# Altium project E4G.PrjPcb
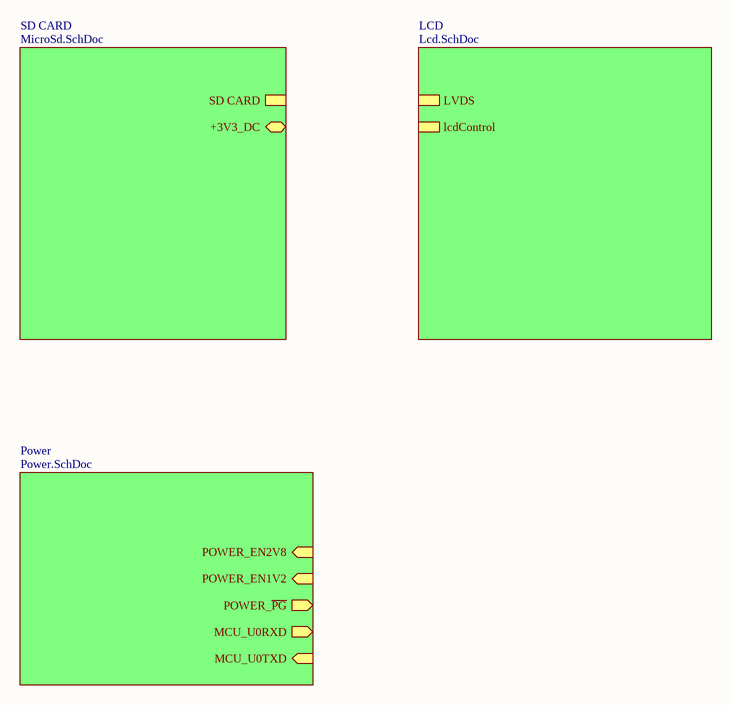
[diagram p0: Main.SchDoc]
4 sheets, 84 parts. Net scope: hierarchical (ports join the sheet entries above them; power ports are global).
Sheets:
  Main.SchDoc
    LCD = Lcd.SchDoc
    SD CARD = MicroSd.SchDoc
  Interfaces.SchDoc

## Sheet Main.SchDoc
size A4; SheetNumber: 1; SheetTotal: 4

### Sub-sheets
LCD = Lcd.SchDoc: LVDS (harness LVDS), lcdControl (harness lcdControl)
Power = Power.SchDoc (file not in this document): POWER_EN2V8 (in), POWER_EN1V2 (in), POWER_~{PG} (out), MCU_U0RXD (out), MCU_U0TXD (in)
SD CARD = MicroSd.SchDoc: SD CARD (harness SDIO), +3V3_DC (bidir, harness +3V3_DC)

## Sheet Lcd.SchDoc
size A4; SheetNumber: 3; SheetTotal: 3; SPICEModelCacheGUJJYSLL: <root> / <DocumentId>GUJJYSLL</DocumentId> / <CacheFrame Number="0"> / <Model Name="bat54s" Kind="CKT"> / <Text>* / .SUBCKT BAT54S 1 2 3 / * The resistors do not reflect / * physical devices.  Instead they / * improve modeling in the reverse / * mode of operation. / * / R1 1 3 3.6E+07 / D1 1 3 BAT54S / R2 3 2 3.6E+07 / D2 3 2 BAT54S / * / .MODEL BAT54S D / +( / +    IS = 2.117E-07 / +    N = 1.016 / +    BV = 36 / +    IBV = 1.196E-06 / +    RS = 2.637 / +    CJO = 1.114E-11 / +    VJ = 0.2013 / +    M = 0.3868 / +    FC = 0 / +    TT = 0 / +    EG = 0.69 / +    XTI = 2 / +) / .ENDS</Text> / </Model> / </CacheFrame> / </root>
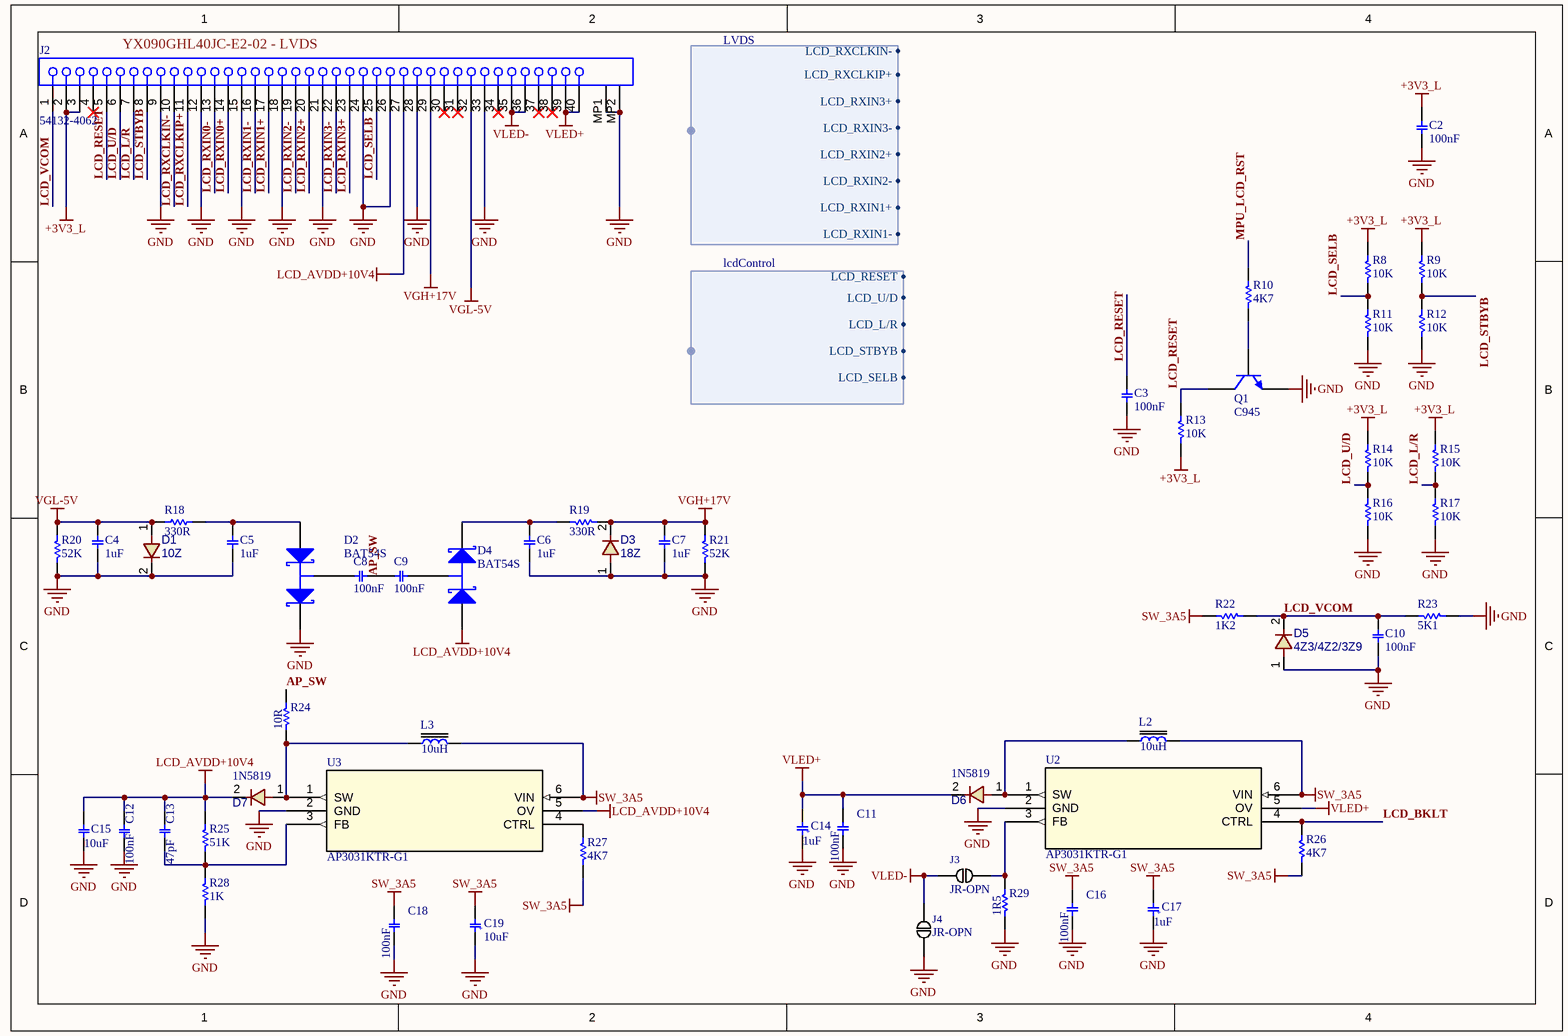
[diagram p1: Lcd.SchDoc]

### Parts
(Parts that share a designator on the sheet are numbered #1, #2 ... from top to bottom, then left to right.)
C2  100nF  [C0603E]
C3  100nF  [C0603E]
C4  1uF  [C0603E]
C5  1uF  [C0603E]
C6  1uF  [C0603E]
C7  1uF  [C0603E]
C8  100nF  [C0603E]
C9  100nF  [C0603E]
C10  100nF  [C0603E]
C11  100nF  [C0603E]
C12  100nF  [C0603E]
C13  47pF  [C0603E]
C14  1uF  [Cap_A]
C15  10uF  [C0603E]
C16  100nF  [C0603E]
C17  1uF  [Cap_A]
C18  100nF  [C0603E]
C19  10uF  [Cap_A]
D1  10Z  [D_SOD80]
D2  BAT54S  [SOT-23]
D3  18Z  [D_SOD80]
D4  BAT54S  [SOT-23]
D5  4Z3/4Z2/3Z9  [D_SOD80]
D6  value 1N5819  [D_SMA]  (hidden comment: 1N5819 SMD SS31)
D7  value 1N5819  [D_SMA]  (hidden comment: 1N5819 SMD SS31)
J2  54132-4062  [MOLX-54132-4062]
J3  JR-OPN
J4  JR-OPN
L2  10uH  [L_XAL1010]
L3  10uH  [L_XAL1010]
Q1  C945  [SOT23_N]
R8  10K  [R0603O]
R9  10K  [R0603O]
R10  4K7  [R0603O]
R11  10K  [R0603O]
R12  10K  [R0603O]
R13  10K  [R0603O]
R14  10K  [R0603O]
R15  10K  [R0603O]
R16  10K  [R0603O]
R17  10K  [R0603O]
R18  330R  [R0603O]
R19  330R  [R0603O]
R20  52K  [R0603O]
R21  52K  [R0603O]
R22#1  1K2  [R0603O]
R23  5K1  [R0603O]
R24#1  10R  [R0603O]
R25#1  51K  [R0603O]
R26#1  4K7  [R0603O]
R27#1  4K7  [R0603O]
R28  1K  [R0603O]
R29  1R5  [R0603O]
U2#1  AP3031KTR-G1  [SOT23-6_DIO]
U3#1  AP3031KTR-G1  [SOT23-6_DIO]

### Harnesses
LVDS: LCD_RXCLKIN-, LCD_RXCLKIP+, LCD_RXIN3+, LCD_RXIN3-, LCD_RXIN2+, LCD_RXIN2-, LCD_RXIN1+, LCD_RXIN1-
lcdControl: LCD_RESET, LCD_U/D, LCD_L/R, LCD_STBYB, LCD_SELB

### Nets
+3V3_L: C2.2 J2.2 J2.3 R8.1 R9.1 R13.2 R14.1 R15.1
GND: C2.1 C3.1 C4.1 C5.1 C6.1 C7.1 C10.1 C11.1 C12.1 C14.2 C15.1 C16.1 C17.2 C18.1 C19.2 D1.2 D2.2(K) D3.1 D5.1 J2.9 J2.12 J2.15 J2.18 J2.21 J2.24 J2.26 J2.28 J2.33 J2.MP1 J2.MP2 J4.2 Q1.2(E) R11.2 R12.1 R16.2 R17.2 R20.1 R21.1 R23.1 R28.1 R29.1 U2#1.2(GND) U3#1.2(GND)
LCD_AVDD+10V4: C12.2 C13.2 C15.2 D4.1(A) D7.2 J2.27 R25#1.2 U3#1.5(OV)
SW_3A5: C16.2 C17.1 C18.2 C19.1 L2.2 L3.2 R22#1.2 R26#1.1 R27#1.1 U2#1.6(VIN) U3#1.6(VIN)
VGH+17V: C7.2 D3.2 J2.29 R19.1 R21.2
VGL-5V: C4.2 D1.1 J2.32 R18.1 R20.2
VLED+: C11.2 C14.1 D6.2 J2.39 J2.40 U2#1.5(OV)
VLED-: J2.35 J2.36 J3.1 J4.1
AP_SW: C8.1 C9.2 R24#1.2
LCD_BKLT: R26#1.2 U2#1.4(CTRL)
LCD_L/R: J2.7 R15.2 R17.1
LCD_RESET: C3.2 J2.5 Q1.3(C) R13.1
LCD_RXCLKIN-: J2.10
LCD_RXCLKIP+: J2.11
LCD_RXIN0+: J2.14
LCD_RXIN0-: J2.13
LCD_RXIN1+: J2.17
LCD_RXIN1-: J2.16
LCD_RXIN2+: J2.20
LCD_RXIN2-: J2.19
LCD_RXIN3+: J2.23
LCD_RXIN3-: J2.22
LCD_SELB: J2.25 R8.2 R11.1
LCD_STBYB: J2.8 R9.2 R12.2
LCD_U/D: J2.6 R14.2 R16.1
LCD_VCOM: C10.2 D5.2 J2.1 R22#1.1 R23.2
MPU_LCD_RST: R10.1
NetC5_2: C5.2 D2.1(A) R18.2
NetC6_2: C6.2 D4.2(K) R19.2
NetC8_2: C8.2 D2.3(C)
NetC9_1: C9.1 D4.3(C)
NetC13_1: C13.1 R25#1.1 R28.2 U3#1.3(FB)
NetD6_1: D6.1 L2.1 U2#1.1(SW)
NetD7_1: D7.1 L3.1 R24#1.1 U3#1.1(SW)
NetJ3_2: J3.2 R29.2 U2#1.3(FB)
NetQ1_1: Q1.1(B) R10.2
NetR27#1_2: R27#1.2 U3#1.4(CTRL)

Not connected (* = marked no-connect by the designer): J2 4* 30* 31* 34* 37* 38*

### Notes on the sheet
- (near J2) YX090GHL40JC-E2-02 - LVDS
- THIS DOCUMENT AND THE DATA DISCLOSED HEREIN OR
- HEREWITH IS THE PROPERTY OF ALTIUM LIMITED AND MAY
- DWG NO:
- REVISION
- REV:
- DESCRIPTION
- DATE
- APPROVED
- BE FREELY DISTRIBUTED IN WHOLE. NO RIGHTS ARE
- RESERVED OR EXPRESS OR IMPLIED WARANTEE GIVEN.
- ENG:
- APPROVALS
- PROJECT
- DSN:
- CHK:
- REFERENCE DOCUMENTS
- PROJECT REVISION:
- TITLE
- DOCUMENT REVISION:
- DESIGN ITEM:
- BOM:
- FAB DWG:
- PCB DWG:
- ASSY DWG:
- SCALE:
- A3
- SIZE
- CAGE CODE
- FILE NAME
- DWG NO.
- SHEET
- OF
- REV
- (in symbol Capacitor Tantalum SMD) +

### Library data of the parts
C2-C12 C15 C16 C18 = Capacitor C SMD 0603
  C2 C3 C8-C12 C16 C18: DatasheetVersion: 2021; ComponentLink1Description: Website Smart World; ComponentLink1URL: https://www.smartw.ir/; ComponentLink2Description: Telegram; ComponentLink2URL: https://t.me/altium_smartw; ComponentLink3Description: Instagram; ComponentLink3URL: https://Instagram.com/smartgw.ir; Value: 100nf
C13 = Capacitor C SMD 0603: Value: 100nf; DatasheetVersion: 2021; ComponentLink1Description: Website Smart World; ComponentLink1URL: https://www.smartw.ir/; ComponentLink2Description: Telegram; ComponentLink2URL: https://t.me/altium_smartw; ComponentLink3Description: Instagram; ComponentLink3URL: https://Instagram.com/smartgw.ir
C14 C17 C19 = Capacitor Tantalum SMD: DatasheetVersion: 2021; ComponentLink1Description: Website Smart World; ComponentLink1URL: https://www.smartw.ir/; ComponentLink2Description: Telegram; ComponentLink2URL: https://t.me/altium_smartw; ComponentLink3Description: Instagram; ComponentLink3URL: https://Instagram.com/smartgw.ir
  C19: Value: 10uF
D1 D3 D5 = 1N4148 SMD: DIODE, FAST SWTICHING, 0.3A, 0.5W
D2 D4 = BAT54S: Schottky Barrier Double Diode; Published: 17-Sep-2003; LatestRevisionDate: 12-Dec-2006; LatestRevisionNote: IPC-7351 Footprint Added.; DatasheetVersion: 4-Mar-2002; PackageVersion: May-1999; PackageReference: SOT23; Publisher: Altium Limited; PackageDescription: 3-Pin SOT-23 Package 0.95 mm Pitch, 2.3 mm Lead Span; ComponentLink1Description: Manufacturer Link; ComponentLink1URL: http://www.semiconductors.philips.com/; ComponentLink2Description: Datasheet; ComponentLink2URL: http://www.semiconductors.philips.com/acrobat/datasheets/BAT54_SERIES_4.pdf
D6 D7 = 1N4007 SMD M7: DIODE, GENERAL PURPOSE, 1000V/1A; DatasheetVersion: 2021; ComponentLink1Description: Website Smart World; ComponentLink1URL: https://www.smartw.ir/; ComponentLink2Description: Telegram; ComponentLink2URL: https://t.me/altium_smartw; ComponentLink3Description: Instagram; ComponentLink3URL: https://Instagram.com/smartgw.ir
J2 = 54132-4062: 0.5 mm Pitch Easy-On(TM) Type FPC Connector, 2.0 mm Mated Height, Right Angle, ZIF, SMT, Bottom Contact, 40 Circuits, -20 to 85 degC, ELV and RoHS Compliant, Tape and Reel; Manufacturer: Molex; Circuits (Loaded): 40; Current (Max per Contact): 0.5A; Durability (mating cycles max): 20; Entry Angle: 90degrees Angle; Mated Height: 2.00mm; Material - Metal: Phosphor Bronze; Material - Plating Mating: Gold; PCB Locator: No; PCB Retention: Yes; Pitch - Mating Interface: 0.50mm; Voltage (Max): 50V; PackageVersion: Rev. F, 07/2010; PackageReference: 54132-4062; PackageDescription: 40-Lead FPC Connector, Pitch 0.5 mm; Supplier 1: Mouser; Supplier Part Number 1: 538-54132-4062; Contact Position: Bottom; Material - Plating Termination: Gold; Number of Rows: 1; Orientation: Right Angle; Packing: Tape and Reel; Polarized to PCB: Yes; RoHS: TRUE; Stackable: No; Mounting Technology: Surface Mount; PartNumber: 54132-4062; ComponentLink1Description: Manufacturer URL; ComponentLink1URL: http://www.molex.com/molex/index.jsp; ComponentLink2Description: Datasheet; ComponentLink2URL: http://www.molex.com/webdocs/datasheets/pdf/en-us/0541324062_FFC_FPC_CONNECTORS.pdf; ComponentLink3Description: Package Specification; ComponentLink3URL: http://www.molex.com/pdm_docs/sd/541324062_sd.pdf
J3 J4 = BYPASS: SOLDERDOT BYPASS; Manufacturer Part Number 1: Board Feature; Reel: Open; Supplier 1: Solder-it-yourself; Manufacturer 1: Board feature
L2 L3 = Inductor SMD Cored 2: ComponentLink1Description: Website Smart World; ComponentLink1URL: https://www.smartw.ir/; ComponentLink2Description: Telegram; ComponentLink2URL: https://t.me/altium_smartw; ComponentLink3Description: Instagram; ComponentLink3URL: https://Instagram.com/smartgw.ir; DatasheetVersion: 2021; Value: 10uH
Q1 = C945: NPN Silicon Epitaxial Planar Transistor; Published: 2017-2-8; LatestRevisionDate: 2017; LatestRevisionNote: IPC-7351 Footprint Added.; DatasheetVersion: 2017; PackageVersion: 2017-2-8; PackageReference: SOT23; Publisher: Abbas Basereh; PackageDescription: 3-Pin SOT-23 Package 0.95 mm Pitch, 2.3 mm Lead Span; ComponentLink1Description: Manufacturer Link; ComponentLink1URL: http://www.taitroncomponents.com/; ComponentLink2Description: Datasheet; ComponentLink2URL: http://www.taitroncomponents.com/
R8-R21 R22#1 R23 R24#1 R25#1 R26#1 R27#1 R28 R29 = Resistor SMD 0603
  R18 R19 R24#1 R29: DatasheetVersion: 2021
U2#1 U3#1 = AP3031KTR-G1: No Description Available; Mfr_Name: Diodes Inc; Copyright: Copyright (C) 2022 Ultra Librarian. All rights reserved.; Manufacturer_Part_Number: AP3031KTR-G1; RefDes: RefDes; Type: DEV

## Sheet MicroSd.SchDoc
size A4; SheetNumber: 2; SheetTotal: 3
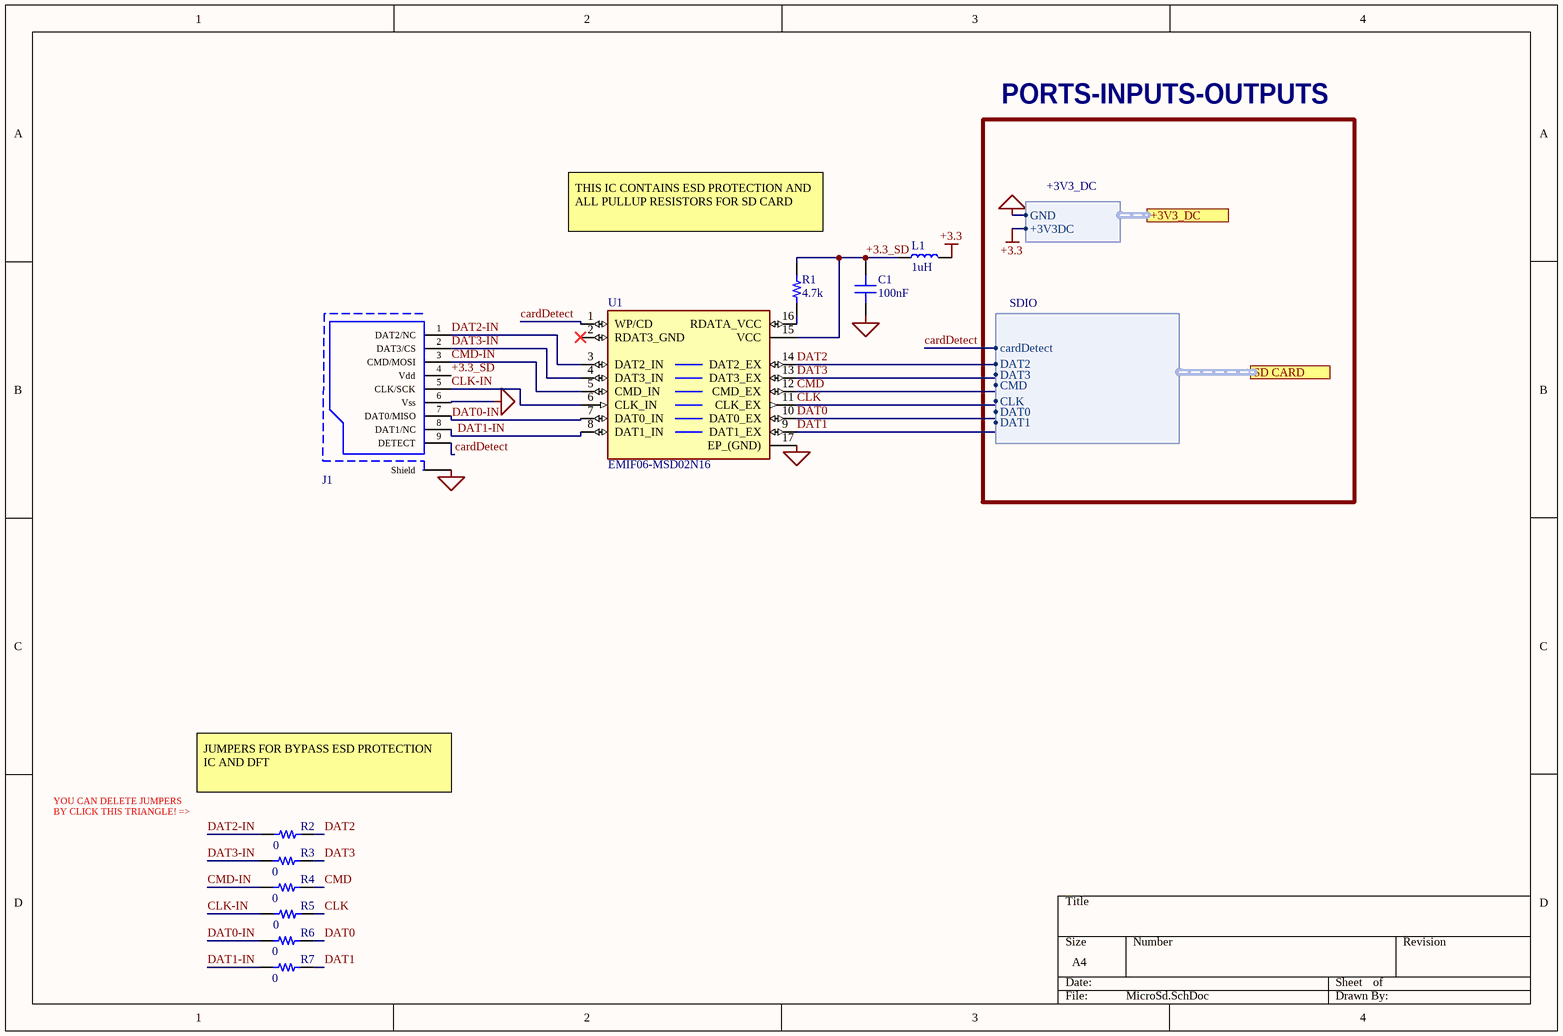
[diagram p2: MicroSd.SchDoc]

### Parts
C1  100nF  [CAP 0603_1608]
J1  Micro SD  [TFP-09-2-12B]  (value not drawn)
L1  1uH  [IND 0805_2012]
R1  4.7k  [RES 0603_1608]
R2  0  [RES 0805_2012]
R3  0  [RES 0805_2012]
R4  0  [RES 0805_2012]
R5  0  [RES 0805_2012]
R6  0  [RES 0805_2012]
R7  0  [RES 0805_2012]
U1  EMIF06-MSD02N16  [EMIF06MSD02N16]

### Ports
+3V3_DC (harness +3V3_DC, see Main[2B]), SD CARD (harness SDIO, see Main[2B])

### Harnesses
SDIO: DAT2, DAT3, CMD, CLK, DAT0, DAT1, cardDetect
+3V3_DC: +3V3DC, GND

### Nets
+3.3: L1.2 ; port +3V3_DC.+3V3DC
IGND: C1.1 J1.6(Vss) J1.10(Shield) U1.17(EP_(GND)) ; port +3V3_DC.GND
+3.3_SD: C1.2 J1.4(Vdd) L1.1 R1.2 U1.15(VCC)
cardDetect: J1.9(DETECT) U1.1(WP/CD) ; port SD CARD.cardDetect
CLK: R5.2 U1.11(CLK_EX) ; port SD CARD.CLK
CLK-IN: J1.5(CLK/SCK) R5.1 U1.6(CLK_IN)
CMD: R4.2 U1.12(CMD_EX) ; port SD CARD.CMD
CMD-IN: J1.3(CMD/MOSI) R4.1 U1.5(CMD_IN)
DAT0: R6.2 U1.10(DAT0_EX) ; port SD CARD.DAT0
DAT0-IN: J1.7(DAT0/MISO) R6.1 U1.7(DAT0_IN)
DAT1: R7.2 U1.9(DAT1_EX) ; port SD CARD.DAT1
DAT1-IN: J1.8(DAT1/NC) R7.1 U1.8(DAT1_IN)
DAT2: R2.2 U1.14(DAT2_EX) ; port SD CARD.DAT2
DAT2-IN: J1.1(DAT2/NC) R2.1 U1.3(DAT2_IN)
DAT3: R3.2 U1.13(DAT3_EX) ; port SD CARD.DAT3
DAT3-IN: J1.2(DAT3/CS) R3.1 U1.4(DAT3_IN)
NetR1_1: R1.1 U1.16(RDATA_VCC)

Not connected (* = marked no-connect by the designer): U1 2(RDAT3_GND)*

### Notes on the sheet
- PORTS-INPUTS-OUTPUTS
- THIS IC CONTAINS ESD PROTECTION AND ALL PULLUP RESISTORS FOR SD CARD
- (near R2) JUMPERS FOR BYPASS ESD PROTECTION IC AND DFT
- YOU CAN DELETE JUMPERS
- BY CLICK THIS TRIANGLE! =>

### Library data of the parts
C1 = Cap 0603: SMT Capacitor; VALUE: 100nF
J1 = Micro SD TFP-09-2-12B: PartNumber: TFP-09-2-12B
L1 = Ind 0805: SMT Inductor; Value: 1uH
R1 = Res 0603: SMT Resistor; VALUE: 1K
R2-R7 = Res 0805: SMT Resistor; VALUE: 1K
U1 = EMIF06-MSD02N16: RC (Pi) EMI Filter 2nd Order Low Pass 6 Channel R = 45Ohms, C = 20pF (Total) 16-UFDFN Exposed Pad; MF: STMicroelectronics; Value: *; Availability: Warning; Price: None; Package: UFDFN-16 STMicroelectronics; MP: EMIF06-MSD02N16; Purchase-URL: https://pricing.snapeda.com/search/part/EMIF06-MSD02N16/?ref=eda; SnapEDA_Link: https://www.snapeda.com/parts/EMIF06-MSD02N16/STMicroelectronics/view-part/274332/?ref=snap

## Sheet Interfaces.SchDoc: RS485 & RS422 Interface
size A4; Author: Farzin Rezaei; DrawnBy: Farzin Rezaei; DocumentNumber: Doc14020803; Revision: 0.0.1
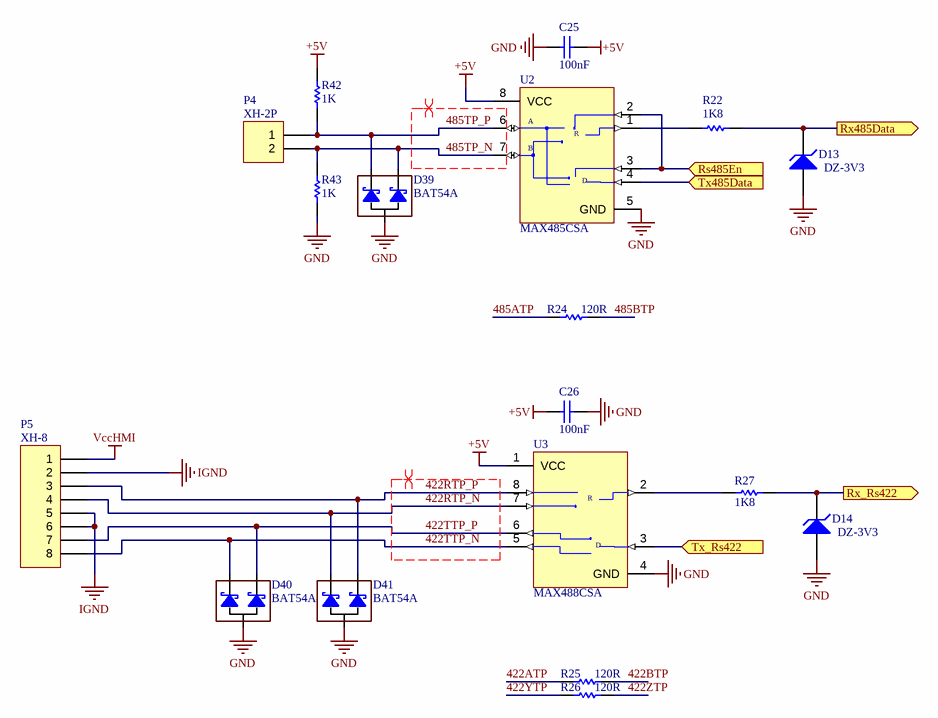
[diagram p3: Interfaces.SchDoc]

### Parts
(Parts that share a designator on the sheet are numbered #1, #2 ... from top to bottom, then left to right.)
C25  100nF  [0603C]
C26  100nF  [0603C]
D13  DZ-3V3  [1206D]
D14  DZ-3V3  [1206D]
D39  BAT54A  [SOT-23-3 2.9X2.4MM P0.95MM]
D40  BAT54A  [SOT-23-3 2.9X2.4MM P0.95MM]
D41  BAT54A  [SOT-23-3 2.9X2.4MM P0.95MM]
P4  XH-2P  [JST-XH-2W]
P5  XH-8  [JST-XH-8W]
R22#2  1K8  [0603R]
R24#2  120R  [0805R]
R25#2  120R  [0805R]
R26#2  120R  [0805R]
R27#2  1K8  [0603R]
R42  1K  [0603R]
R43  1K  [0603R]
U2#2  MAX485CSA  [SO-8]
U3#2  MAX488CSA  [SO-8]

### Ports
Rs485En (in), Rx485Data (out), Rx_Rs422 (out), Tx485Data (in), Tx_Rs422 (in)

### Nets
+5V: C25.2 C26.2 R42.2 U2#2.8(VCC) U3#2.1(VCC)
GND: C25.1 C26.1 D13.1(A) D14.1(A) D39.3 D40.3 D41.3 R43.1 U2#2.5(GND) U3#2.4(GND)
IGND: P5.2 P5.5 P5.6
VccHMI: P5.1
422ATP: R25#2.1
422BTP: R25#2.2
422RTP_N: D41.2 P5.4 U3#2.7(B)
422RTP_P: D41.1 P5.3 U3#2.8(A)
422TTP_N: D40.2 P5.8 U3#2.5(Y)
422TTP_P: D40.1 P5.7 U3#2.6(Z)
422YTP: R26#2.1
422ZTP: R26#2.2
485ATP: R24#2.1
485BTP: R24#2.2
485TP_N: D39.1 P4.2 R43.2 U2#2.7(B)
485TP_P: D39.2 P4.1 R42.1 U2#2.6(A)
NetD13_2: D13.2(K) R22#2.2 ; port Rx485Data
NetD14_2: D14.2(K) R27#2.2 ; port Rx_Rs422
NetR22#2_1: R22#2.1 U2#2.1(RO)
NetR27#2_1: R27#2.1 U3#2.2(RO)
NetU2#2_2: U2#2.2(~{RE}) U2#2.3(DE) ; port Rs485En
NetU2#2_4: U2#2.4(DI) ; port Tx485Data
NetU3#2_3: U3#2.3(DI) ; port Tx_Rs422

### Layout directives
differential pair; rule Differential Pairs Routing [Pref Gap = 15mil    Min Gap  = 10mil    Max Gap  = 15milPref Width = 15mil    Min Width  = 15mil    Max Width  = 20mil]; net class RsBusClass; differential pair class RsBusClassRs422: 422RTP_N, 422RTP_P, 422TTP_N, 422TTP_P
differential pair; rule Differential Pairs Routing [Pref Gap = 15mil    Min Gap  = 10mil    Max Gap  = 15milPref Width = 15mil    Min Width  = 15mil    Max Width  = 20mil]; net class RsBusClass; differential pair class RsBusClassRs485: 485TP_N, 485TP_P

### Notes on the sheet
- (in symbol MAX485CSA) R; D
- (in symbol MAX488CSA) R; D

### Library data of the parts
C25 C26 = Cap: Value: 100nF
D13 D14 = D Zener
D39-D41 = BAT54A (SMD): Diode Array 1 Pair Series Connection Schottky 30V 200mA Surface Mount TO-236-3, SC-59, SOT-23-3; PartNumber: BAT54A
P4 = Header 2
P5 = Header 8: Header, 8-Pin; LatestRevisionDate: 17-Jul-2002; LatestRevisionNote: Re-released for DXP Platform.; Publisher: Altium Limited
R22#2 = Res1: Value: 120R
R24#2 R25#2 R26#2 R42 R43 = Res1
  R24#2 R25#2 R26#2: Value: 120R
  R42 R43: Value: 1K
R27#2 = Res1: Value: 1K
U3#2 = MAX488CSA: montage: true; DatasheetVersion: Feb-1996; Code_JEDEC: MS-012-AA; Code_IPC: SOIC127P600-8; ComponentLink1Description: Manufacturer Link; ComponentLink1URL: http://www.maxim-ic.com/; ComponentLink2Description: Datasheet; ComponentLink2URL: http://pdfserv.maxim-ic.com/en/ds/MAX1487-MAX491.pdf
U2#2 = MAX485CSA: DatasheetVersion: Feb-1996; Code_JEDEC: MS-012-AA; Code_IPC: SOIC127P600-8; ComponentLink1Description: Manufacturer Link; ComponentLink1URL: http://www.maxim-ic.com/; ComponentLink2Description: Datasheet; ComponentLink2URL: http://pdfserv.maxim-ic.com/en/ds/MAX1487-MAX491.pdf

## Nets that join several sheets
GND: Lcd (43 pins), Interfaces (10 pins)
IGND: MicroSd (C1.1 J1.6 J1.10 U1.17), Interfaces (P5.2 P5.5 P5.6)